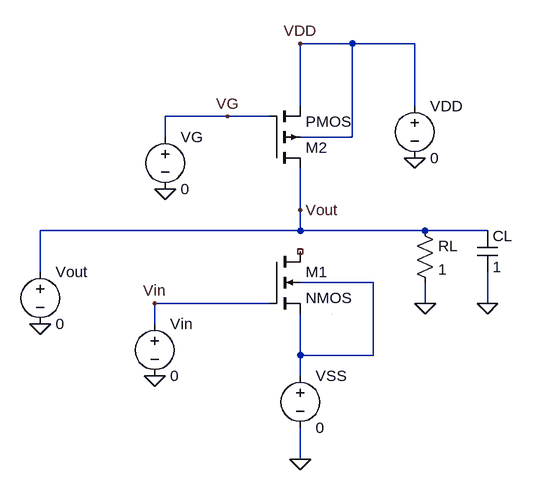
[diagram p0: schematic Chapter04E_01b.fig.asc]
Chapter04E_01b.fig.asc, the LTspice schematic file:
Version 4
SHEET 1 2940 740
WIRE 32 -416 -48 -416
WIRE 128 -416 32 -416
WIRE -48 -320 -48 -416
WIRE 128 -320 128 -416
WIRE -160 -304 -256 -304
WIRE -96 -304 -160 -304
WIRE -256 -272 -256 -304
WIRE 32 -272 32 -416
WIRE 32 -272 -48 -272
WIRE -48 -160 -48 -224
WIRE -48 -128 -48 -160
WIRE -48 -128 -448 -128
WIRE 144 -128 -48 -128
WIRE 240 -128 144 -128
WIRE -448 -64 -448 -128
WIRE 64 -48 -48 -48
WIRE -96 -16 -272 -16
WIRE 144 -16 144 -48
WIRE 240 -16 240 -64
WIRE -272 16 -272 -16
WIRE -48 64 -48 0
WIRE 64 64 64 -48
WIRE 64 64 -48 64
WIRE -48 96 -48 64
WIRE -48 224 -48 176
WIRE 0 0 0 0
FLAG 128 -240 0
FLAG -48 224 0
FLAG -272 96 0
FLAG -48 -416 VDD
FLAG -272 -16 Vin
FLAG -48 -160 Vout
FLAG -256 -192 0
FLAG -160 -304 VG
FLAG 144 -16 0
FLAG 240 -16 0
FLAG -448 16 0
SYMBOL nmos4 -96 -96 R0
SYMATTR InstName M1
SYMBOL pmos4 -96 -224 M180
SYMATTR InstName M2
SYMBOL voltage 128 -336 R0
SYMATTR InstName VDD
SYMATTR Value 0
SYMBOL voltage -272 0 R0
WINDOW 123 0 0 Left 0
WINDOW 39 0 0 Left 0
SYMATTR InstName Vin
SYMATTR Value 0
SYMBOL voltage -256 -288 R0
SYMATTR InstName VG
SYMATTR Value 0
SYMBOL res 128 -144 R0
SYMATTR InstName RL
SYMATTR Value 1
SYMBOL cap 224 -128 R0
SYMATTR InstName CL
SYMATTR Value 1
SYMBOL voltage -48 80 R0
SYMATTR InstName VSS
SYMATTR Value 0
SYMBOL voltage -448 -80 R0
SYMATTR InstName Vout
SYMATTR Value 0

The netlist it stands for:
* Chapter04E_01b.fig.asc
M1 NC_01 Vin N001 N001 NMOS
M2 Vout VG VDD VDD PMOS
VDD VDD 0 0
Vin Vin 0 0
VG VG 0 0
RL Vout 0 1
CL Vout 0 1
VSS N001 0 0
Vout Vout 0 0
.model NMOS NMOS
.model PMOS PMOS
.lib standard.mos
.backanno
.end